# EAGLE design LED42056-Board (EAGLE 9.0.0)
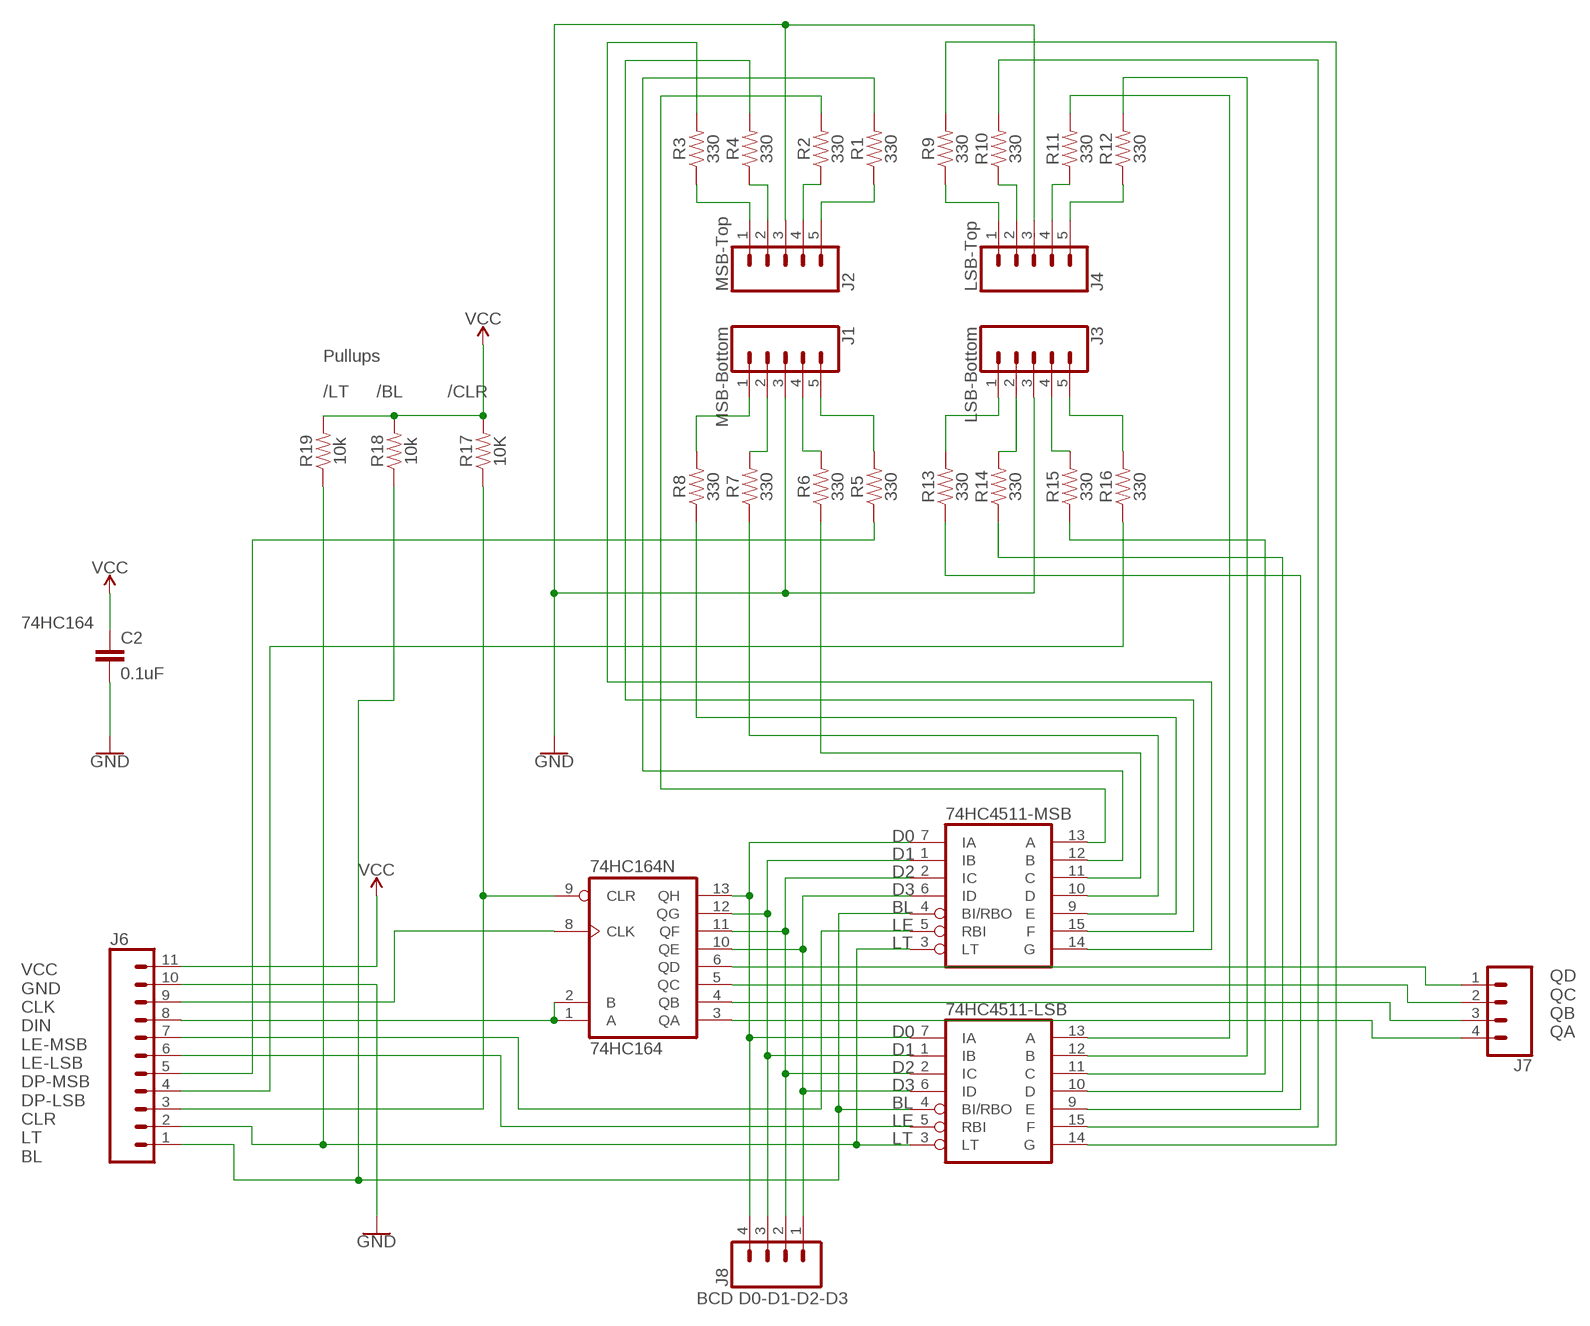
[diagram p0: schematic, sheet 1]

## Parts
74HC164  74HC164N  [DIL14]
74HC4511-LSB  74LS47N  [DIL16]
74HC4511-MSB  74LS47N  [DIL16]
C2  0.1uF  22PF-PTH-2.54MM-200V-5%  [CAP-PTH-2.54]
J1  MSB-Bottom  CONN_05LOCK  [1X05_LOCK]
J2  MSB-Top  CONN_05LOCK  [1X05_LOCK]
J3  LSB-Bottom  CONN_05LOCK  [1X05_LOCK]
J4  LSB-Top  CONN_05LOCK  [1X05_LOCK]
J6  CONN_11LOCK  [1X11_LOCK]
J7  CONN_04LOCK  [1X04_LOCK]
J8  CONN_04LOCK  [1X04_LOCK]
R1  330  330OHM-HORIZ-1/10W-5%  [AXIAL-0.3]
R2  330  330OHM-HORIZ-1/10W-5%  [AXIAL-0.3]
R3  330  330OHM-HORIZ-1/10W-5%  [AXIAL-0.3]
R4  330  330OHM-HORIZ-1/10W-5%  [AXIAL-0.3]
R5  330  330OHM-HORIZ-1/10W-5%  [AXIAL-0.3]
R6  330  330OHM-HORIZ-1/10W-5%  [AXIAL-0.3]
R7  330  330OHM-HORIZ-1/10W-5%  [AXIAL-0.3]
R8  330  330OHM-HORIZ-1/10W-5%  [AXIAL-0.3]
R9  330  330OHM-HORIZ-1/10W-5%  [AXIAL-0.3]
R10  330  330OHM-HORIZ-1/10W-5%  [AXIAL-0.3]
R11  330  330OHM-HORIZ-1/10W-5%  [AXIAL-0.3]
R12  330  330OHM-HORIZ-1/10W-5%  [AXIAL-0.3]
R13  330  330OHM-HORIZ-1/10W-5%  [AXIAL-0.3]
R14  330  330OHM-HORIZ-1/10W-5%  [AXIAL-0.3]
R15  330  330OHM-HORIZ-1/10W-5%  [AXIAL-0.3]
R16  330  330OHM-HORIZ-1/10W-5%  [AXIAL-0.3]
R17  10K  330OHM-HORIZ-1/10W-5%  [AXIAL-0.3]
R18  10k  10KOHM-HORIZ-1/4W-1%  [AXIAL-0.3]
R19  10k  10KOHM-HORIZ-1/4W-1%  [AXIAL-0.3]

## Nets
GND: C2.2 J1.3 J2.3 J3.3 J4.3 J6.10
N$1: J2.1 R3.P$1
N$2: J2.2 R4.P$1
N$3: J2.4 R2.P$1
N$4: J2.5 R1.P$1
N$5: J4.1 R9.P$1
N$6: J4.2 R10.P$1
N$7: J4.4 R11.P$1
N$8: J4.5 R12.P$1
N$9: J3.5 R16.P$2
N$10: J3.4 R15.P$2
N$11: J3.2 R14.P$2
N$12: J3.1 R13.P$2
N$13: J1.5 R5.P$2
N$14: J1.4 R6.P$2
N$15: J1.2 R7.P$2
N$16: J1.1 R8.P$2
N$17: 74HC164.13(QH) 74HC4511-LSB.7(IA) 74HC4511-MSB.7(IA) J8.4
N$18: 74HC164.12(QG) 74HC4511-LSB.1(IB) 74HC4511-MSB.1(IB) J8.3
N$19: 74HC164.11(QF) 74HC4511-LSB.2(IC) 74HC4511-MSB.2(IC) J8.2
N$20: 74HC164.10(QE) 74HC4511-LSB.6(ID) 74HC4511-MSB.6(ID) J8.1
N$21: 74HC164.8(CLK) J6.9
N$22: 74HC164.1(A) 74HC164.2(B) J6.8
N$23: 74HC164.9(CLR) J6.3 R17.P$1
N$24: 74HC4511-MSB.5(RBI) J6.7
N$25: 74HC4511-LSB.5(RBI) J6.6
N$26: 74HC4511-LSB.4(BI/RBO) 74HC4511-MSB.4(BI/RBO) J6.1 R18.P$1
N$27: 74HC4511-LSB.3(LT) 74HC4511-MSB.3(LT) J6.2 R19.P$1
N$28: 74HC4511-LSB.13(A) R11.P$2
N$30: 74HC4511-MSB.13(A) R2.P$2
N$31: 74HC4511-MSB.12(B) R1.P$2
N$32: 74HC4511-MSB.11(C) R6.P$1
N$33: 74HC4511-MSB.10(D) R7.P$1
N$34: 74HC4511-MSB.9(E) R8.P$1
N$35: 74HC4511-MSB.15(F) R4.P$2
N$36: 74HC4511-MSB.14(G) R3.P$2
N$37: 74HC4511-LSB.12(B) R12.P$2
N$38: 74HC4511-LSB.11(C) R15.P$1
N$39: 74HC4511-LSB.10(D) R14.P$1
N$40: 74HC4511-LSB.9(E) R13.P$1
N$41: 74HC4511-LSB.15(F) R10.P$2
N$42: 74HC4511-LSB.14(G) R9.P$2
N$43: J6.5 R5.P$1
N$44: J6.4 R16.P$1
N$45: 74HC164.6(QD) J7.1
N$46: 74HC164.5(QC) J7.2
N$47: 74HC164.4(QB) J7.3
N$48: 74HC164.3(QA) J7.4
VCC: C2.1 J6.11 R17.P$2 R18.P$2 R19.P$2

## Notes on the sheet
- Pullups
- /LT | /BL | /CLR
- 74HC164
- D0
- D1
- D2
- D3
- BL
- LE
- LT
- D0
- QD
  QC
  QB
  QA
- D1
- D2
- D3
- BL
- LE
- LT
- VCC
  GND
  CLK
  DIN
  LE-MSB
  LE-LSB
  DP-MSB
  DP-LSB
  CLR
  LT
  BL
- BCD D0-D1-D2-D3

## Power pins joined to a net without a drawn wire
GND: 74HC164.7(GND) 74HC4511-LSB.8(GND) 74HC4511-MSB.8(GND)
VCC: 74HC164.14(VCC) 74HC4511-LSB.16(VCC) 74HC4511-MSB.16(VCC)

## Library data of the parts
74HC164 = 74xx-us:74*164: 8-bit parallel out SHIFT REGISTER
74HC4511-LSB 74HC4511-MSB = 74xx-us:74*47: BCD to seven segment DECODER/DRIVER Source: http://www.ee.washington.edu/stores/DataSheets/74ls/74ls47.pdf
C2 = SparkFun-Capacitors:22PF: 22pF ceramic capacitors A capacitor is a passive two-terminal electrical component used to store electrical energy temporarily in an electric field.; PROD_ID: CAP-09128; VALUE: 22pF
J1-J4 = SparkFun-Connectors:CONN_05: Multi connection point. Often used as Generic Header-pin footprint for 0.1 inch spaced/style header connections On any of the 0.1 inch spaced packages, you can populate with these: Break Away Headers - Straight <https://www.sparkfun.com/products/116> (PRT-00116) Break Away Male Headers - Right Angle <https://www.sparkfun.com/products/553> (PRT-00553) Female Headers <https://www.sparkfun.com/products/115> (PRT-00115) Break Away Headers - Machine Pin <https://www.sparkfun.com/products/117> (PRT-00117) Break Away Female Headers - Swiss Machine Pin <https://www.sparkfun.com/products/743> (PRT-00743) For SCREWTERMINALS and SPRING TERMINALS visit here: Screw Terimnals on SparkFun.com <https://www.sparkfun.com/search/results?term=Screw+Terminals> (5mm/3.5mm/2.54mm spacing) This device is also useful as a general connection point to wire up your design to another part of your project. Our various solder wires solder well into these plated through hole pads. Hook-Up Wire - Assortment (Stranded, 22 AWG) <https://www.sparkfun.com/products/11375> (PRT-11375) Hook-Up Wire - Assortment (Solid Core, 22 AWG) <https://www.sparkfun.com/products/11367> (PRT-11367) View the entire wire category on our website here <https://www.sparkfun.com/categories/141> Special notes: Molex polarized connector foot print use with SKU : PRT-08231 with associated crimp pins and housings. 1MM SMD Version SKU: PRT-10208
J6 = SparkFun-Connectors:CONN_11: Multi connection point. Often used as Generic Header-pin footprint for 0.1 inch spaced/style header connections On any of the 0.1 inch spaced packages, you can populate with these: Break Away Headers - Straight <https://www.sparkfun.com/products/116> (PRT-00116) Break Away Male Headers - Right Angle <https://www.sparkfun.com/products/553> (PRT-00553) Female Headers <https://www.sparkfun.com/products/115> (PRT-00115) Break Away Headers - Machine Pin <https://www.sparkfun.com/products/117> (PRT-00117) Break Away Female Headers - Swiss Machine Pin <https://www.sparkfun.com/products/743> (PRT-00743) For SCREWTERMINALS and SPRING TERMINALS visit here: Screw Terimnals on SparkFun.com <https://www.sparkfun.com/search/results?term=Screw+Terminals> (5mm/3.5mm/2.54mm spacing) This device is also useful as a general connection point to wire up your design to another part of your project. Our various solder wires solder well into these plated through hole pads. Hook-Up Wire - Assortment (Stranded, 22 AWG) <https://www.sparkfun.com/products/11375> (PRT-11375) Hook-Up Wire - Assortment (Solid Core, 22 AWG) <https://www.sparkfun.com/products/11367> (PRT-11367) View the entire wire category on our website here <https://www.sparkfun.com/categories/141>
J7 J8 = SparkFun-Connectors:CONN_04: Multi connection point. Often used as Generic Header-pin footprint for 0.1 inch spaced/style header connections On any of the 0.1 inch spaced packages, you can populate with these: Break Away Headers - Straight <https://www.sparkfun.com/products/116> (PRT-00116) Break Away Male Headers - Right Angle <https://www.sparkfun.com/products/553> (PRT-00553) Female Headers <https://www.sparkfun.com/products/115> (PRT-00115) Break Away Headers - Machine Pin <https://www.sparkfun.com/products/117> (PRT-00117) Break Away Female Headers - Swiss Machine Pin <https://www.sparkfun.com/products/743> (PRT-00743) For SCREWTERMINALS and SPRING TERMINALS visit here: Screw Terimnals on SparkFun.com <https://www.sparkfun.com/search/results?term=Screw+Terminals> (5mm/3.5mm/2.54mm spacing) This device is also useful as a general connection point to wire up your design to another part of your project. Our various solder wires solder well into these plated through hole pads. Hook-Up Wire - Assortment (Stranded, 22 AWG) <https://www.sparkfun.com/products/11375> (PRT-11375) Hook-Up Wire - Assortment (Solid Core, 22 AWG) <https://www.sparkfun.com/products/11367> (PRT-11367) View the entire wire category on our website here <https://www.sparkfun.com/categories/141> Special notes: Molex polarized connector foot print use with SKU : PRT-08231 with associated crimp pins and housings. 1MM SMD Version SKU: PRT-10208; PROD_ID: CONN-09696
R1-R16 = SparkFun-Resistors:330OHM: 330Ω resistor A resistor is a passive two-terminal electrical component that implements electrical resistance as a circuit element. Resistors act to reduce current flow, and, at the same time, act to lower voltage levels within circuits. - Wikipedia; PROD_ID: RES-8371
R17 = SparkFun-Resistors:330OHM: 330Ω resistor A resistor is a passive two-terminal electrical component that implements electrical resistance as a circuit element. Resistors act to reduce current flow, and, at the same time, act to lower voltage levels within circuits. - Wikipedia; PROD_ID: RES-8371; VALUE: 330
R18 R19 = SparkFun-Resistors:10KOHM: 10kΩ resistor A resistor is a passive two-terminal electrical component that implements electrical resistance as a circuit element. Resistors act to reduce current flow, and, at the same time, act to lower voltage levels within circuits. - Wikipedia; PROD_ID: RES-12183

## Board
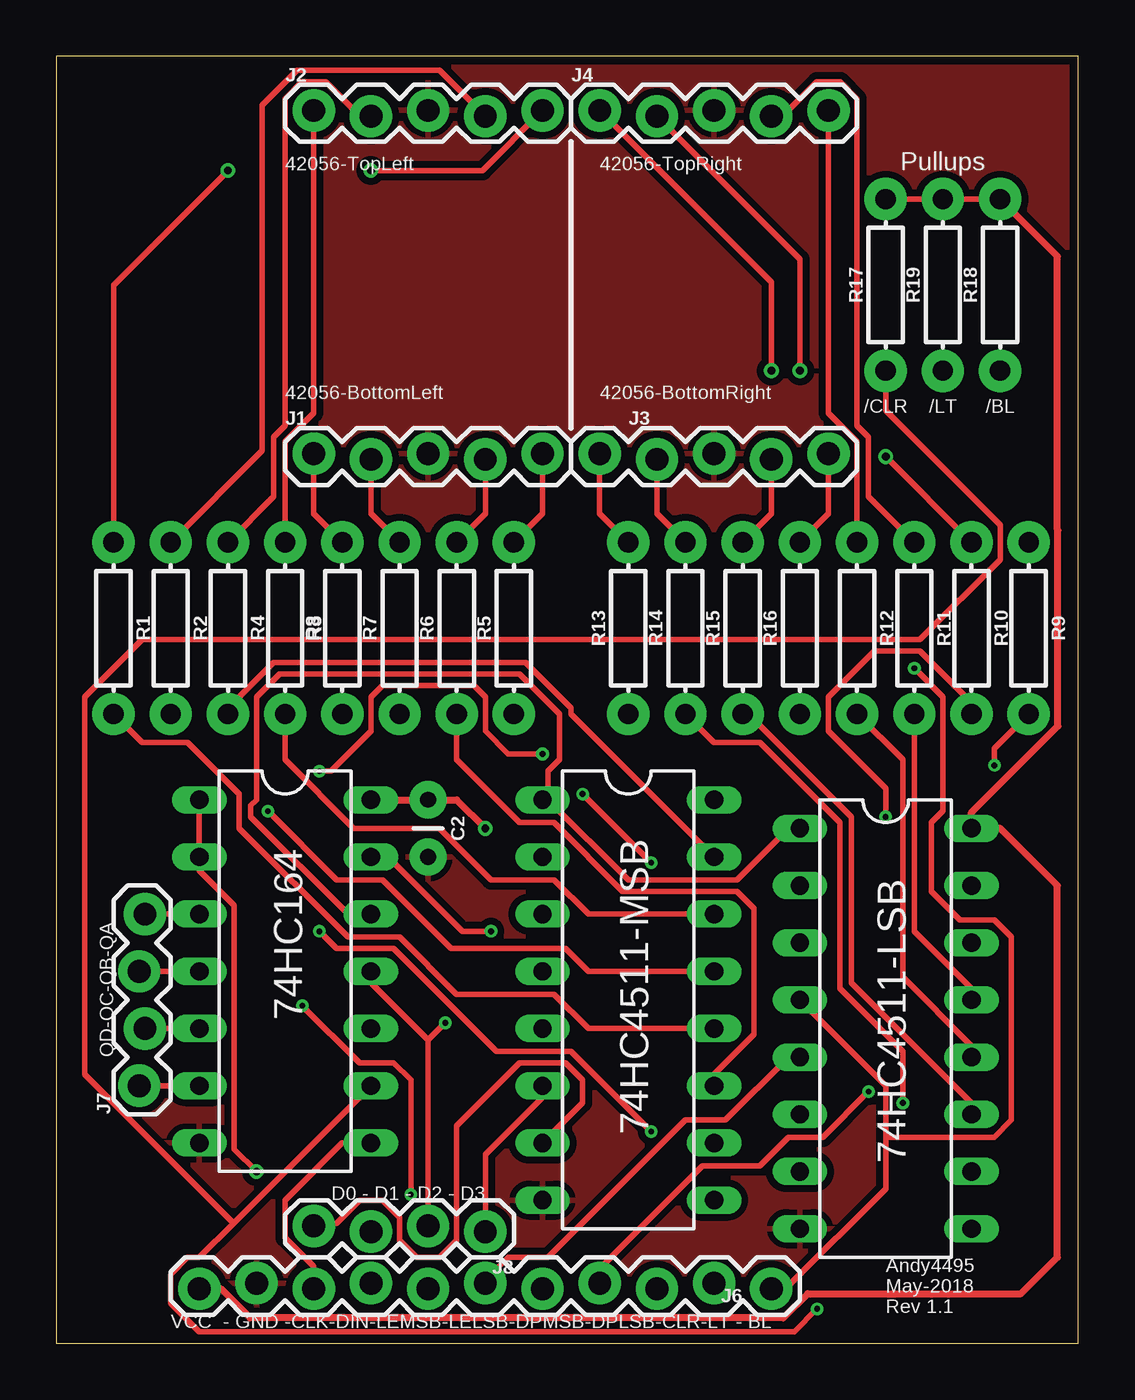
[diagram p1: board, top side]
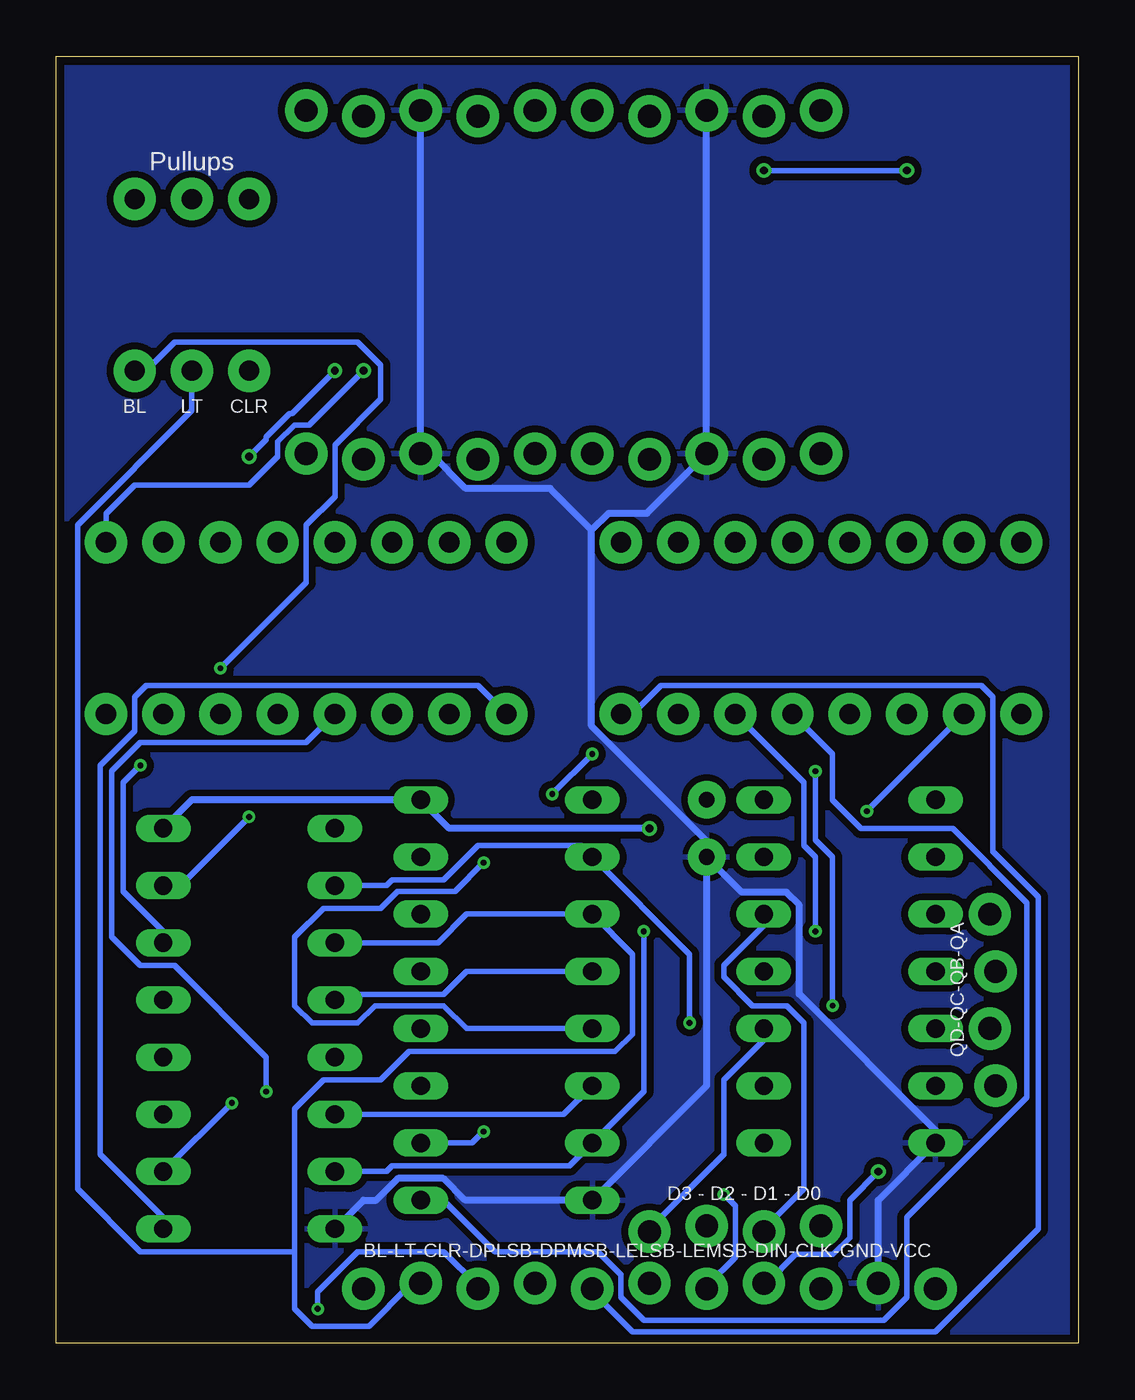
[diagram p2: board, bottom side, seen from below]

Size 45.39 x 57.14 mm. Coordinates in mm from the lower left corner, seen from the top.
Outline: 0,0 45.39,0 45.39,57.14 0,57.14 0,0
Copper layers (1*16): Top 0.035559375mm / dielectric 1.6mm / Bottom 0.035559375mm
Design rules "oshpark-2layer-auto-routing": minimum track width 10mil, minimum drill 10mil, track to track 10mil, track to pad 8mil, pad to pad 8mil, via to via 8mil, smd to smd 6mil, copper to edge 15mil, drill to drill 6mil, minimum pad ring 6mil, minimum via ring 6mil, stop-mask expansion 2.5mil, vias tented up to drill 0mil, thermal gap 10mil

### Footprints (pad centres in the part's own frame; a part is rotated, then mirrored left to right if it is on the bottom)
DIL14 = drill 0.813 long: 1 -7.62,-3.81; 2 -5.08,-3.81; 3 -2.54,-3.81; 4 0,-3.81; 5 2.54,-3.81; 6 5.08,-3.81; 7 7.62,-3.81; 8 7.62,3.81; 9 5.08,3.81; 10 2.54,3.81; 11 0,3.81; 12 -2.54,3.81; 13 -5.08,3.81; 14 -7.62,3.81
DIL16 = drill 0.813 long: 1 -8.89,-3.81; 2 -6.35,-3.81; 3 -3.81,-3.81; 4 -1.27,-3.81; 5 1.27,-3.81; 6 3.81,-3.81; 7 6.35,-3.81; 8 8.89,-3.81; 9 8.89,3.81; 10 6.35,3.81; 11 3.81,3.81; 12 1.27,3.81; 13 -1.27,3.81; 14 -3.81,3.81; 15 -6.35,3.81; 16 -8.89,3.81
CAP-PTH-2.54 = drill 0.7 pad 1.651: 1 -1.27,0; 2 1.27,0
1X05_LOCK = drill 1.016 pad 1.88: 1 0,0.127; 2 2.54,-0.127; 3 5.08,0.127; 4 7.62,-0.127; 5 10.16,0.127
1X11_LOCK = drill 1.016 pad 1.88: 1 0,0.127; 2 2.54,-0.127; 3 5.08,0.127; 4 7.62,-0.127; 5 10.16,0.127; 6 12.7,-0.127; 7 15.24,0.127; 8 17.78,-0.127; 9 20.32,0.127; 10 22.86,-0.127; 11 25.4,0.127
1X04_LOCK = drill 1.016 pad 1.88: 1 0,0.127; 2 2.54,-0.127; 3 5.08,0.127; 4 7.62,-0.127
AXIAL-0.3 = drill 0.9 pad 1.88: P$1 -3.81,0; P$2 3.81,0

### Placement (x,y rotation side)
74HC164  10.16,16.51 270 top
74HC4511-LSB  36.83,13.97 270 top
74HC4511-MSB  25.4,15.24 270 top
C2  16.51,22.86 270 top
J1  11.43,39.37 0 top
J2  11.43,54.61 0 top
J3  24.13,39.37 0 top
J4  24.13,54.61 0 top
J6  31.75,2.54 180 top
J7  3.81,11.43 90 top
J8  19.05,5.08 180 top
R1  2.54,31.75 270 top
R2  5.08,31.75 270 top
R3  10.16,31.75 270 top
R4  7.62,31.75 270 top
R5  20.32,31.75 90 top
R6  17.78,31.75 90 top
R7  15.24,31.75 90 top
R8  12.7,31.75 90 top
R9  43.18,31.75 270 top
R10  40.64,31.75 270 top
R11  38.1,31.75 270 top
R12  35.56,31.75 270 top
R13  25.4,31.75 90 top
R14  27.94,31.75 90 top
R15  30.48,31.75 90 top
R16  33.02,31.75 90 top
R17  36.83,46.99 90 top
R18  41.91,46.99 90 top
R19  39.37,46.99 90 top

### Tracks (layer width: path | path; a pad name or v marks a point on that pad's centre or on a via)
GND
  Bottom 0.305: J6.10 8.89,6.35 74HC164.7 6.35,9.46 12.39,15.5 12.39,19.45 12.96,20.02 14.93,20.02 C2.2 | C2.2 16.51,11.43 74HC4511-MSB.8 27.23,6.35 28.2,7.31 30.22,7.31 31.18,6.35 31.75,6.35 74HC4511-LSB.8 | 21.62,36.1 20.86,36.85 19.15,36.85 J1.3 J2.3 | 21.62,36.1 21.62,27.4 16.51,22.3 C2.2 | 21.62,36.1 23.47,37.95 27.21,37.95 28.76,39.5 J3.3 J4.3
  pour Top (isolate 0.305): 0,57.15 45.72,57.15 45.72,0 0,0
  pour Bottom (isolate 0.305): 0,57.15 45.72,57.15 45.72,0 0,0
N$1
  Top 0.254: J2.1 11.43,41.29 10.16,40.02 R3.P$1
N$2
  Top 0.254: J2.2 13.48,54.48 11.96,56.01 10.9,56.01 10.16,55.26 10.16,40.74 9.65,40.23 9.65,37.59 R4.P$1
N$3
  Top 0.254: J2.4 17.02,56.52 10.69,56.52 9.14,54.96 9.14,39.62 R2.P$1
N$4  (via drill 0.35)
  Top 0.254: J2.5 18.92,52.07 v13.97,52.07 | v7.62,52.07 2.54,46.99 R1.P$1
  Bottom 0.254: v13.97,52.07 v7.62,52.07
N$5  (via drill 0.35)
  Top 0.254: J4.1 31.75,47.12 v31.75,43.18
  Bottom 0.254: v31.75,43.18 34.16,40.77 34.82,40.77 35.56,40.02 35.56,39.37 36.83,38.1 41.91,38.1 43.18,36.83 R9.P$1
N$6  (via drill 0.35)
  Top 0.254: J4.2 33.02,48.13 v33.02,43.18 | v36.83,39.37 R10.P$1
  Bottom 0.254: v33.02,43.18 34.92,41.27 35.03,41.27 36.07,40.23 36.07,40.13 v36.83,39.37
N$7
  Top 0.254: J4.4 32.24,54.48 33.76,56.01 34.82,56.01 35.56,55.26 35.56,40.74 36.07,40.23 36.07,37.59 R11.P$1
N$8
  Top 0.254: J4.5 34.29,41.29 35.56,40.02 R12.P$1
N$9
  Top 0.254: J3.5 34.29,36.83 R16.P$2
N$10
  Top 0.254: J3.4 31.75,36.83 R15.P$2
N$11
  Top 0.254: J3.2 26.67,36.83 R14.P$2
N$12
  Top 0.254: J3.1 24.13,36.83 R13.P$2
N$13
  Top 0.254: J1.5 21.59,36.83 R5.P$2
N$14
  Top 0.254: J1.4 19.05,36.83 R6.P$2
N$15
  Top 0.254: J1.2 13.97,36.83 R7.P$2
N$16
  Top 0.254: J1.1 11.43,36.83 R8.P$2
N$17  (via drill 0.25)
  Top 0.254: 74HC164.13 14.73,21.59 18.03,18.29 v19.3,18.29 | 74HC4511-MSB.7 23.37,10.67 23.37,11.68 22.61,12.45 20.57,12.45 17.78,9.65 17.78,4.57 17.02,3.81 16,3.81 15.24,4.57 15.24,5.59 14.48,6.35 13.46,6.35 12.45,5.33 11.43,5.33 J8.4
  Bottom 0.254: v19.3,18.29 19.3,11.18 74HC4511-MSB.7 22.61,7.87 30.48,7.87 30.73,7.62 74HC4511-LSB.7
N$18
  Top 0.254: 74HC4511-LSB.1 32.51,22.86 30.23,20.57 25.4,20.57 21.84,24.13 | 21.84,24.13 21.84,25.4 22.35,25.91 22.35,27.94 20.57,29.72 9.91,29.72 8.89,28.7 8.89,24.13 8.64,23.88 8.64,23.37 12.95,19.05 74HC164.12 | 21.84,24.13 74HC4511-MSB.1
  Bottom 0.254: 74HC164.12 13.97,18.54 15.75,16.76 15.75,16.26 14.48,14.99 12.95,14.99 12.19,14.22 12.19,6.86 13.97,5.08 J8.3
N$19  (via drill 0.25)
  Top 0.254: 74HC164.11 13.97,16 16.51,13.46 | J8.2 16.51,13.46 | 16.51,13.46 v17.27,14.22
  Bottom 0.254: 74HC4511-LSB.2 30.73,20.32 30.48,20.57 28.19,20.57 26.67,22.1 22.1,22.1 74HC4511-MSB.2 17.27,17.27 v17.27,14.22
N$20
  Top 0.254: 74HC4511-MSB.6 21.59,10.92 19.05,8.38 J8.1
  Bottom 0.254: 74HC164.10 13.97,13.46 15.75,11.68 15.75,8.38 19.05,5.08 J8.1 | 74HC4511-LSB.6 22.86,10.16 74HC4511-MSB.6
N$21
  Top 0.254: J6.9 11.43,3.41 10.16,4.68 10.16,6.35 12.7,8.89 74HC164.8
N$22  (via drill 0.35)
  Top 0.254: 74HC164.1 74HC164.2 6.35,20.99 7.9,19.44 7.9,8.61 v8.89,7.62
  Bottom 0.254: J6.8 13.84,2.67 12.57,3.94 10.9,3.94 10.16,4.68 10.16,6.35 v8.89,7.62
N$23  (via drill 0.25)
  Top 0.254: 7.87,5.33 6.35,3.81 5.84,3.81 5.08,3.05 5.08,1.78 6.35,0.51 32.77,0.51 v33.78,1.52 | 7.87,5.33 74HC164.9 | R17.P$1 36.83,41.4 41.91,36.32 41.91,34.8 38.35,31.24 3.81,31.24 1.27,28.7 1.27,11.94 7.87,5.33
  Bottom 0.254: v33.78,1.52 33.78,2.29 32,4.06 28.19,4.06 26.67,2.54 J6.3
N$24  (via drill 0.25)
  Top 0.254: v23.37,24.38 v26.42,21.34 | v21.59,26.16 20.07,26.16 19.05,27.18 19.05,28.7 18.54,29.21 14.48,29.21 13.97,28.7 13.97,27.18 12.19,25.4 v11.68,25.4 | v10.92,14.99 13.46,12.45 14.99,12.45 15.75,11.68 v15.75,6.6
  Bottom 0.254: 74HC4511-MSB.5 27.18,13.97 28.19,14.99 31.24,14.99 32,14.22 34.04,14.22 34.8,14.99 34.8,18.03 33.53,19.3 30.99,19.3 30.23,20.07 27.69,20.07 v26.42,21.34 | v21.59,26.16 v23.37,24.38 | v11.68,25.4 11.68,22.35 10.92,21.59 v10.92,14.99 | v15.75,6.6 15.24,6.1 15.24,3.81 16.51,2.54 J6.7
N$25
  Top 0.254: 74HC4511-LSB.5 32.51,12.7 29.72,9.91 27.94,9.91 21.84,3.81 20.07,3.81 19.05,2.79 J6.6
N$26  (via drill 0.25)
  Top 0.254: 36.83,9.14 36.83,11.43 74HC4511-LSB.4 | 36.83,9.14 36.83,6.86 32.51,2.54 31.75,2.54 J6.1 | v38.1,29.97 39.37,28.7 39.37,23.62 38.86,23.11 38.86,20.07 40.13,18.8 41.66,18.8 42.42,18.03 42.42,9.91 41.66,9.14 36.83,9.14
  Bottom 0.254: 74HC4511-MSB.4 27.18,16.51 28.19,15.49 32.77,15.49 74HC4511-LSB.4 | R18.P$1 41.4,43.18 40.13,44.45 32,44.45 30.99,43.43 30.99,41.91 33.02,39.88 33.02,37.59 34.29,36.32 34.29,33.78 v38.1,29.97
N$27
  Bottom 0.254: 74HC4511-LSB.3 28.45,17.78 27.18,19.05 74HC4511-MSB.3 19.81,17.27 19.81,13.72 20.57,12.95 29.72,12.95 30.99,11.68 33.53,11.68 34.8,10.41 34.8,4.06 | 34.8,4.06 34.8,1.52 34.04,0.76 31.5,0.76 29.72,2.54 29.21,2.54 J6.2 | R19.P$1 39.37,41.4 44.45,36.32 44.45,6.86 41.66,4.06 34.8,4.06
N$28
  Top 0.254: 74HC4511-LSB.13 40.64,15.75 38.1,18.29 R11.P$2
N$30  (via drill 0.25)
  Top 0.254: 74HC4511-MSB.13 23.62,16.51 22.61,17.53 17.53,17.53 14.48,20.57 12.45,20.57 v9.4,23.62
  Bottom 0.254: R2.P$2 v9.4,23.62
N$31
  Top 0.254: 74HC4511-MSB.12 23.62,13.97 22.1,15.49 17.78,15.49 15.24,18.03 12.95,18.03 8.13,22.86 8.13,24.38 5.84,26.67 3.81,26.67 R1.P$2
N$32
  Top 0.254: 74HC4511-MSB.11 29.21,11.94 30.99,13.72 30.99,19.3 30.23,20.07 25.15,20.07 22.1,23.11 20.57,23.11 17.78,25.91 R6.P$1
N$33  (via drill 0.25)
  Top 0.254: v26.42,9.4 22.86,12.95 19.56,12.95 14.99,17.53 12.45,17.53 v11.68,18.29
  Bottom 0.254: 74HC4511-MSB.10 26.92,8.89 v26.42,9.4 | v11.68,18.29 11.68,21.59 12.19,22.1 12.19,24.89 R7.P$1
N$34
  Bottom 0.254: 74HC4511-MSB.9 28.19,6.35 25.91,4.06 21.34,4.06 20.32,3.05 20.32,2.03 19.3,1.02 8.64,1.02 7.62,2.03 7.62,5.59 2.29,10.92 2.29,19.56 5.59,22.86 9.65,22.86 10.92,24.13 10.92,26.16 R8.P$1
N$35
  Top 0.254: 74HC4511-MSB.15 22.86,27.94 22.86,28.19 20.83,30.23 9.65,30.23 7.62,28.19 R4.P$2
N$36
  Top 0.254: 74HC4511-MSB.14 23.62,19.05 22.1,20.57 19.3,20.57 17.02,22.86 13.21,22.86 10.16,25.91 R3.P$2
N$37
  Top 0.254: 74HC4511-LSB.12 40.64,13.21 37.59,16.26 37.59,25.91 R12.P$2
N$38
  Top 0.254: 74HC4511-LSB.11 40.64,10.67 35.31,16 35.31,23.37 30.73,27.94 R15.P$1
N$39  (via drill 0.25)
  Top 0.254: v37.59,10.67 37.59,12.95 34.8,15.75 34.8,23.11 31.24,26.67 29.21,26.67 R14.P$1
  Bottom 0.254: v37.59,10.67 74HC4511-LSB.10
N$40
  Bottom 0.254: 74HC4511-LSB.9 40.64,5.59 43.43,8.38 43.43,25.65 41.91,27.18 41.91,28.7 41.4,29.21 26.67,29.21 R13.P$1
N$41  (via drill 0.25)
  Top 0.254: v36.83,23.37 36.83,24.64 34.29,27.18 34.29,28.7 36.32,30.73 38.35,30.73 40.64,28.45 R10.P$2
  Bottom 0.254: 74HC4511-LSB.15 39.88,20.32 v36.83,23.37
N$42  (via drill 0.25)
  Top 0.254: v41.66,25.65 41.66,26.42 R9.P$2
  Bottom 0.254: 74HC4511-LSB.14 40.64,18.29 42.42,20.07 42.42,24.89 v41.66,25.65
N$43
  Bottom 0.254: R5.P$1 19.81,27.94 18.54,29.21 4.32,29.21 3.81,28.7 3.81,21.84 1.78,19.81 1.78,5.08 6.35,0.51 19.81,0.51 21.59,2.29 J6.5
N$44  (via drill 0.25)
  Top 0.254: J6.4 24.13,3.3 28.7,7.87 31.24,7.87 32.51,9.14 34.04,9.14 v36.07,11.18
  Bottom 0.254: v36.07,11.18 36.07,12.7 40.13,16.76 41.66,16.76 42.93,18.03 42.93,25.4 41.66,26.67 34.29,26.67 R16.P$1
N$45
  Top 0.254: J7.1 74HC164.6
N$46
  Top 0.254: J7.2 74HC164.5
N$47
  Top 0.254: J7.3 74HC164.4
N$48
  Top 0.254: J7.4 74HC164.3
VCC  (via drill 0.35)
  Top 0.254: R18.P$2 R19.P$2 R17.P$2
  Top 0.305: 74HC164.14 C2.1 17.78,24.13 v19.05,22.86 | J6.11 7.31,2.41 8.61,1.12 32.29,1.12 33.36,2.2 42.84,2.2 44.45,3.81 44.45,20.32 41.91,22.86 74HC4511-LSB.16 40.64,23.57 44.47,27.4 44.47,36.1 44.45,36.12 44.45,48.26 R18.P$2
  Bottom 0.305: v19.05,22.86 27.94,22.86 74HC4511-MSB.16 39.37,24.13 74HC4511-LSB.16

### Text on the board
tPlace: 42056-TopLeft | 42056-TopRight | Pullups | 42056-BottomLeft | 42056-BottomRight | /CLR | /LT | /BL | QD-QC-QB-QA | D0 - D1 - D2 - D3 | Andy4495 / May-2018 / Rev 1.1 | VCC - GND -CLK-DIN-LEMSB-LELSB-DPMSB-DPLSB-CLR-LT - BL
bPlace: Pullups | CLR | LT | BL | QD-QC-QB-QA | D3 - D2 - D1 - D0 | BL-LT-CLR-DPLSB-DPMSB-LELSB-LEMSB-DIN-CLK-GND-VCC